# Altium schematic sheet Connectors.SchDoc
size A4
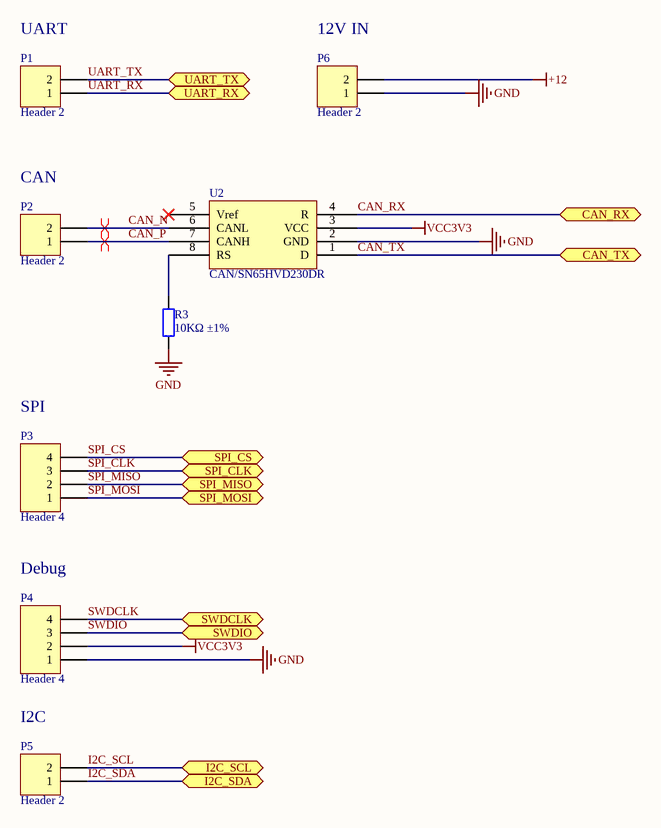
[diagram p0: Connectors.SchDoc]

## Parts
P1  Header 2  [HDR1X2]
P2  Header 2  [HDR1X2]
P3  Header 4  [HDR1X4]
P4  Header 4  [HDR1X4]
P5  Header 2  [HDR1X2]
P6  Header 2  [HDR1X2]
R3  10KΩ ±1%  [0402_R]
U2  CAN/SN65HVD230DR  [SOIC-8_150mil]

## Ports
CAN_RX (bidir), CAN_TX (bidir), I2C_SCL (bidir), I2C_SDA (bidir), SPI_CLK (bidir), SPI_CS (bidir), SPI_MISO (bidir), SPI_MOSI (bidir), SWDCLK (bidir), SWDIO (bidir), UART_RX (bidir), UART_TX (bidir)

## Nets
+12: P6.2
GND: P4.1 P6.1 R3.1 U2.2(GND)
VCC3V3: P4.2 U2.3(VCC)
CAN_N: P2.2 U2.6(CANL)
CAN_P: P2.1 U2.7(CANH)
CAN_RX: U2.4(R) ; port CAN_RX
CAN_TX: U2.1(D) ; port CAN_TX
I2C_SCL: P5.2 ; port I2C_SCL
I2C_SDA: P5.1 ; port I2C_SDA
SPI_CLK: P3.3 ; port SPI_CLK
SPI_CS: P3.4 ; port SPI_CS
SPI_MISO: P3.2 ; port SPI_MISO
SPI_MOSI: P3.1 ; port SPI_MOSI
SWDCLK: P4.4 ; port SWDCLK
SWDIO: P4.3 ; port SWDIO
UART_RX: P1.1 ; port UART_RX
UART_TX: P1.2 ; port UART_TX
NetR3_2: R3.2 U2.8(RS)

Not connected (* = marked no-connect by the designer): U2 5(Vref)*

## Layout directives
differential pair: CAN_N, CAN_P

## Notes on the sheet
- (near P1) UART
- (near P6) 12V IN
- (near P2) CAN
- (near P3) SPI
- Debug
- I2C

## Library data of the parts
P1 P2 P5 P6 = Header 2: Header, 2-Pin; LatestRevisionDate: 17-Jul-2002; LatestRevisionNote: Re-released for DXP Platform.; Publisher: Altium Limited
P3 P4 = Header 4: Header, 4-Pin; LatestRevisionDate: 17-Jul-2002; LatestRevisionNote: Re-released for DXP Platform.; Publisher: Altium Limited
R3 = 0402 10K (1002) 1%: Chip resistor; Manufacturer: Uniroyal Elec; PartNumber: 0402WGF1002TCE; Power: 1/16W; ComponentLink1Description: Supplier link; ComponentLink1URL: http://www.szlcsc.com/product/details_26487.html; Package: 0402; Supplier: LC; SuppliersPartNumber: C25744; Resistance: 10KΩ; Tolerance: 1%
U2 = CAN/SN65HVD230DR_[C12084]: CAN; ComponentLink1Description: 供应商链接; ComponentLink1URL: http://www.szlcsc.com/product/details_12661.html; Package: SOIC-8_150mil; Supplier: LC; SuppliersPartNumber: C12084